# Altium schematic sheet TOP.SchDoc
size A4; Organization: Altium Limited; Address1: L3, 12a Rodborough Rd; Address2: Frenchs Forest; Address3: NSW; Address4: Australia 2086
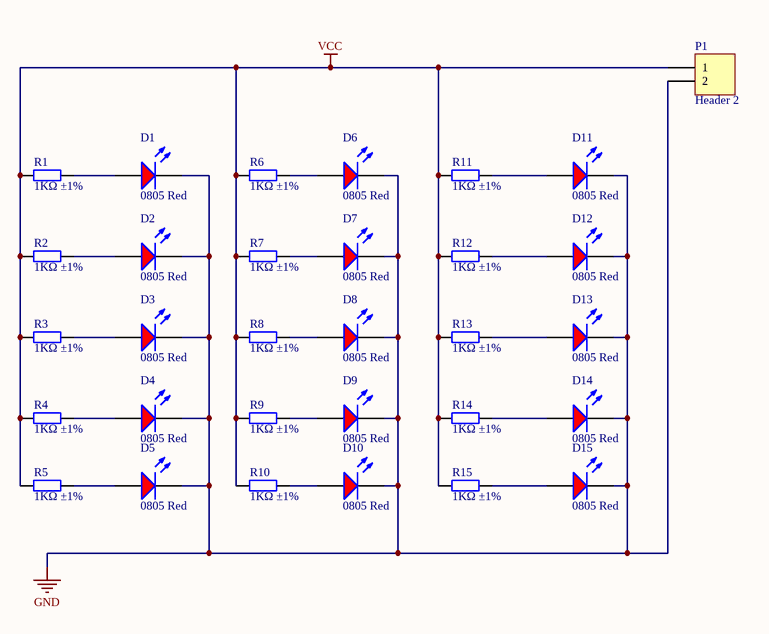
[diagram p0: TOP.SchDoc]

## Parts
D1  0805 Red  [0805_LED_S1]
D2  0805 Red  [0805_LED_S1]
D3  0805 Red  [0805_LED_S1]
D4  0805 Red  [0805_LED_S1]
D5  0805 Red  [0805_LED_S1]
D6  0805 Red  [0805_LED_S1]
D7  0805 Red  [0805_LED_S1]
D8  0805 Red  [0805_LED_S1]
D9  0805 Red  [0805_LED_S1]
D10  0805 Red  [0805_LED_S1]
D11  0805 Red  [0805_LED_S1]
D12  0805 Red  [0805_LED_S1]
D13  0805 Red  [0805_LED_S1]
D14  0805 Red  [0805_LED_S1]
D15  0805 Red  [0805_LED_S1]
P1  Header 2  [HDR1X2]
R1  1KΩ ±1%  [0805_R]
R2  1KΩ ±1%  [0805_R]
R3  1KΩ ±1%  [0805_R]
R4  1KΩ ±1%  [0805_R]
R5  1KΩ ±1%  [0805_R]
R6  1KΩ ±1%  [0805_R]
R7  1KΩ ±1%  [0805_R]
R8  1KΩ ±1%  [0805_R]
R9  1KΩ ±1%  [0805_R]
R10  1KΩ ±1%  [0805_R]
R11  1KΩ ±1%  [0805_R]
R12  1KΩ ±1%  [0805_R]
R13  1KΩ ±1%  [0805_R]
R14  1KΩ ±1%  [0805_R]
R15  1KΩ ±1%  [0805_R]

## Nets
GND: D1.K D2.K D3.K D4.K D5.K D6.K D7.K D8.K D9.K D10.K D11.K D12.K D13.K D14.K D15.K P1.2
VCC: P1.1 R1.1 R2.1 R3.1 R4.1 R5.1 R6.1 R7.1 R8.1 R9.1 R10.1 R11.1 R12.1 R13.1 R14.1 R15.1
NetD1_A: D1.A R1.2
NetD2_A: D2.A R2.2
NetD3_A: D3.A R3.2
NetD4_A: D4.A R4.2
NetD5_A: D5.A R5.2
NetD6_A: D6.A R6.2
NetD7_A: D7.A R7.2
NetD8_A: D8.A R8.2
NetD9_A: D9.A R9.2
NetD10_A: D10.A R10.2
NetD11_A: D11.A R11.2
NetD12_A: D12.A R12.2
NetD13_A: D13.A R13.2
NetD14_A: D14.A R14.2
NetD15_A: D15.A R15.2

## Notes on the sheet
- Title
- Size:
- Date:
- A4
- Number:
- Time:
- Revision:
- Sheet
- of
- File:

## Library data of the parts
D1-D15 = 0805 LED Red: LED; PartNumber: FC-2012HRK-620D; Manufacturer: Foshan NationStar Optoelectronics; ComponentLink1Description: 供应商链接; ComponentLink1URL: http://www.szlcsc.com/product/details_2668.html; Package: 0805; Supplier: LC; SuppliersPartNumber: C84256; Color: Red
P1 = Header 2: Header, 2-Pin; LatestRevisionDate: 17-Jul-2002; LatestRevisionNote: Re-released for DXP Platform.; Publisher: Altium Limited
R1-R15 = 0805 1K (1001) 1%: Chip resistor; Manufacturer: Uniroyal Elec; PartNumber: 0805W8F1001T5E; Power: 1/8W; ComponentLink1Description: Supplier link; ComponentLink1URL: http://www.szlcsc.com/product/details_18201.html; Package: 0805; Supplier: LC; SuppliersPartNumber: C17513; Resistance: 1KΩ; Tolerance: 1%